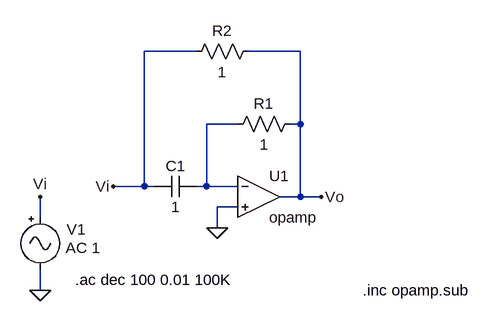
[diagram p0: schematic ej3a.asc]
ej3a.asc, the LTspice schematic file:
Version 4
SHEET 1 880 680
WIRE 64 -48 -16 -48
WIRE 224 -48 144 -48
WIRE 128 64 80 64
WIRE 224 64 224 -48
WIRE 224 64 208 64
WIRE -16 160 -16 -48
WIRE -16 160 -64 160
WIRE 0 160 -16 160
WIRE 80 160 80 64
WIRE 80 160 64 160
WIRE 128 160 80 160
WIRE 224 176 224 64
WIRE 224 176 192 176
WIRE 256 176 224 176
WIRE 128 192 96 192
WIRE -176 208 -176 176
WIRE 96 224 96 192
WIRE -176 320 -176 288
FLAG 96 224 0
FLAG -176 320 0
FLAG -176 176 Vi
FLAG -64 160 Vi
FLAG 256 176 Vo
SYMBOL OpAmps\\opamp 160 112 R0
SYMATTR InstName U1
SYMBOL cap 64 144 R90
WINDOW 0 0 32 VBottom 2
WINDOW 3 32 32 VTop 2
SYMATTR InstName C1
SYMATTR Value 1
SYMBOL res 224 48 R90
WINDOW 0 0 56 VBottom 2
WINDOW 3 32 56 VTop 2
SYMATTR InstName R1
SYMATTR Value 1
SYMBOL res 160 -64 R90
WINDOW 0 0 56 VBottom 2
WINDOW 3 32 56 VTop 2
SYMATTR InstName R2
SYMATTR Value 1
SYMBOL Misc\\signal -176 192 R0
WINDOW 0 41 34 Left 2
WINDOW 123 39 63 Left 2
WINDOW 39 0 0 Left 0
SYMATTR InstName V1
SYMATTR Value ""
SYMATTR Value2 AC 1
TEXT 320 320 Left 2 !.inc opamp.sub
TEXT -122 304 Left 2 !.ac dec 100 0.01 100K

The netlist it stands for:
* ej3a.asc
XU1 N001 0 Vo opamp Aol=100K GBW=10Meg  ; pins invin noninvin out
C1 N001 Vi 1
R1 Vo N001 1
R2 Vo Vi 1
V1 Vi 0 AC 1
.inc opamp.sub
.ac dec 100 0.01 100K
.backanno
.end